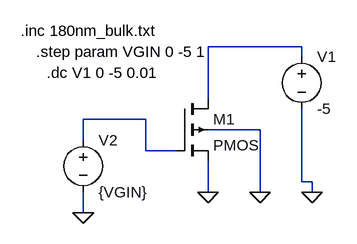
[diagram p0: schematic PMOS_Char3.asc]
PMOS_Char3.asc, the LTspice schematic file:
Version 4
SHEET 1 880 680
WIRE 352 48 208 48
WIRE 352 64 352 48
WIRE 208 128 208 48
WIRE 112 160 16 160
WIRE 288 176 208 176
WIRE 16 192 16 160
WIRE 112 208 112 160
WIRE 160 208 112 208
WIRE 352 256 352 144
WIRE 368 256 352 256
WIRE 208 272 208 224
WIRE 288 272 288 176
WIRE 368 272 368 256
WIRE 16 304 16 272
FLAG 16 304 0
FLAG 208 272 0
FLAG 288 272 0
FLAG 368 272 0
SYMBOL pmos4 160 128 R0
SYMATTR InstName M1
SYMBOL voltage 352 48 R0
WINDOW 123 0 0 Left 0
WINDOW 39 0 0 Left 0
SYMATTR InstName V1
SYMATTR Value -5
SYMBOL voltage 16 176 R0
WINDOW 123 0 0 Left 0
WINDOW 39 0 0 Left 0
SYMATTR InstName V2
SYMATTR Value {VGIN}
TEXT -80 24 Left 2 !.inc 180nm_bulk.txt
TEXT -56 56 Left 2 !.step param VGIN 0 -5 1
TEXT -40 88 Left 2 !.dc V1 0 -5 0.01

The netlist it stands for:
* PMOS_Char3.asc
M1 N001 N002 0 0 PMOS
V1 N001 0 -5
V2 N002 0 {VGIN}
.model NMOS NMOS
.model PMOS PMOS
.lib standard.mos
.inc 180nm_bulk.txt
.step param VGIN 0 -5 1
.dc V1 0 -5 0.01
.backanno
.end